# Altium schematic sheet Balance.SchDoc
size A3
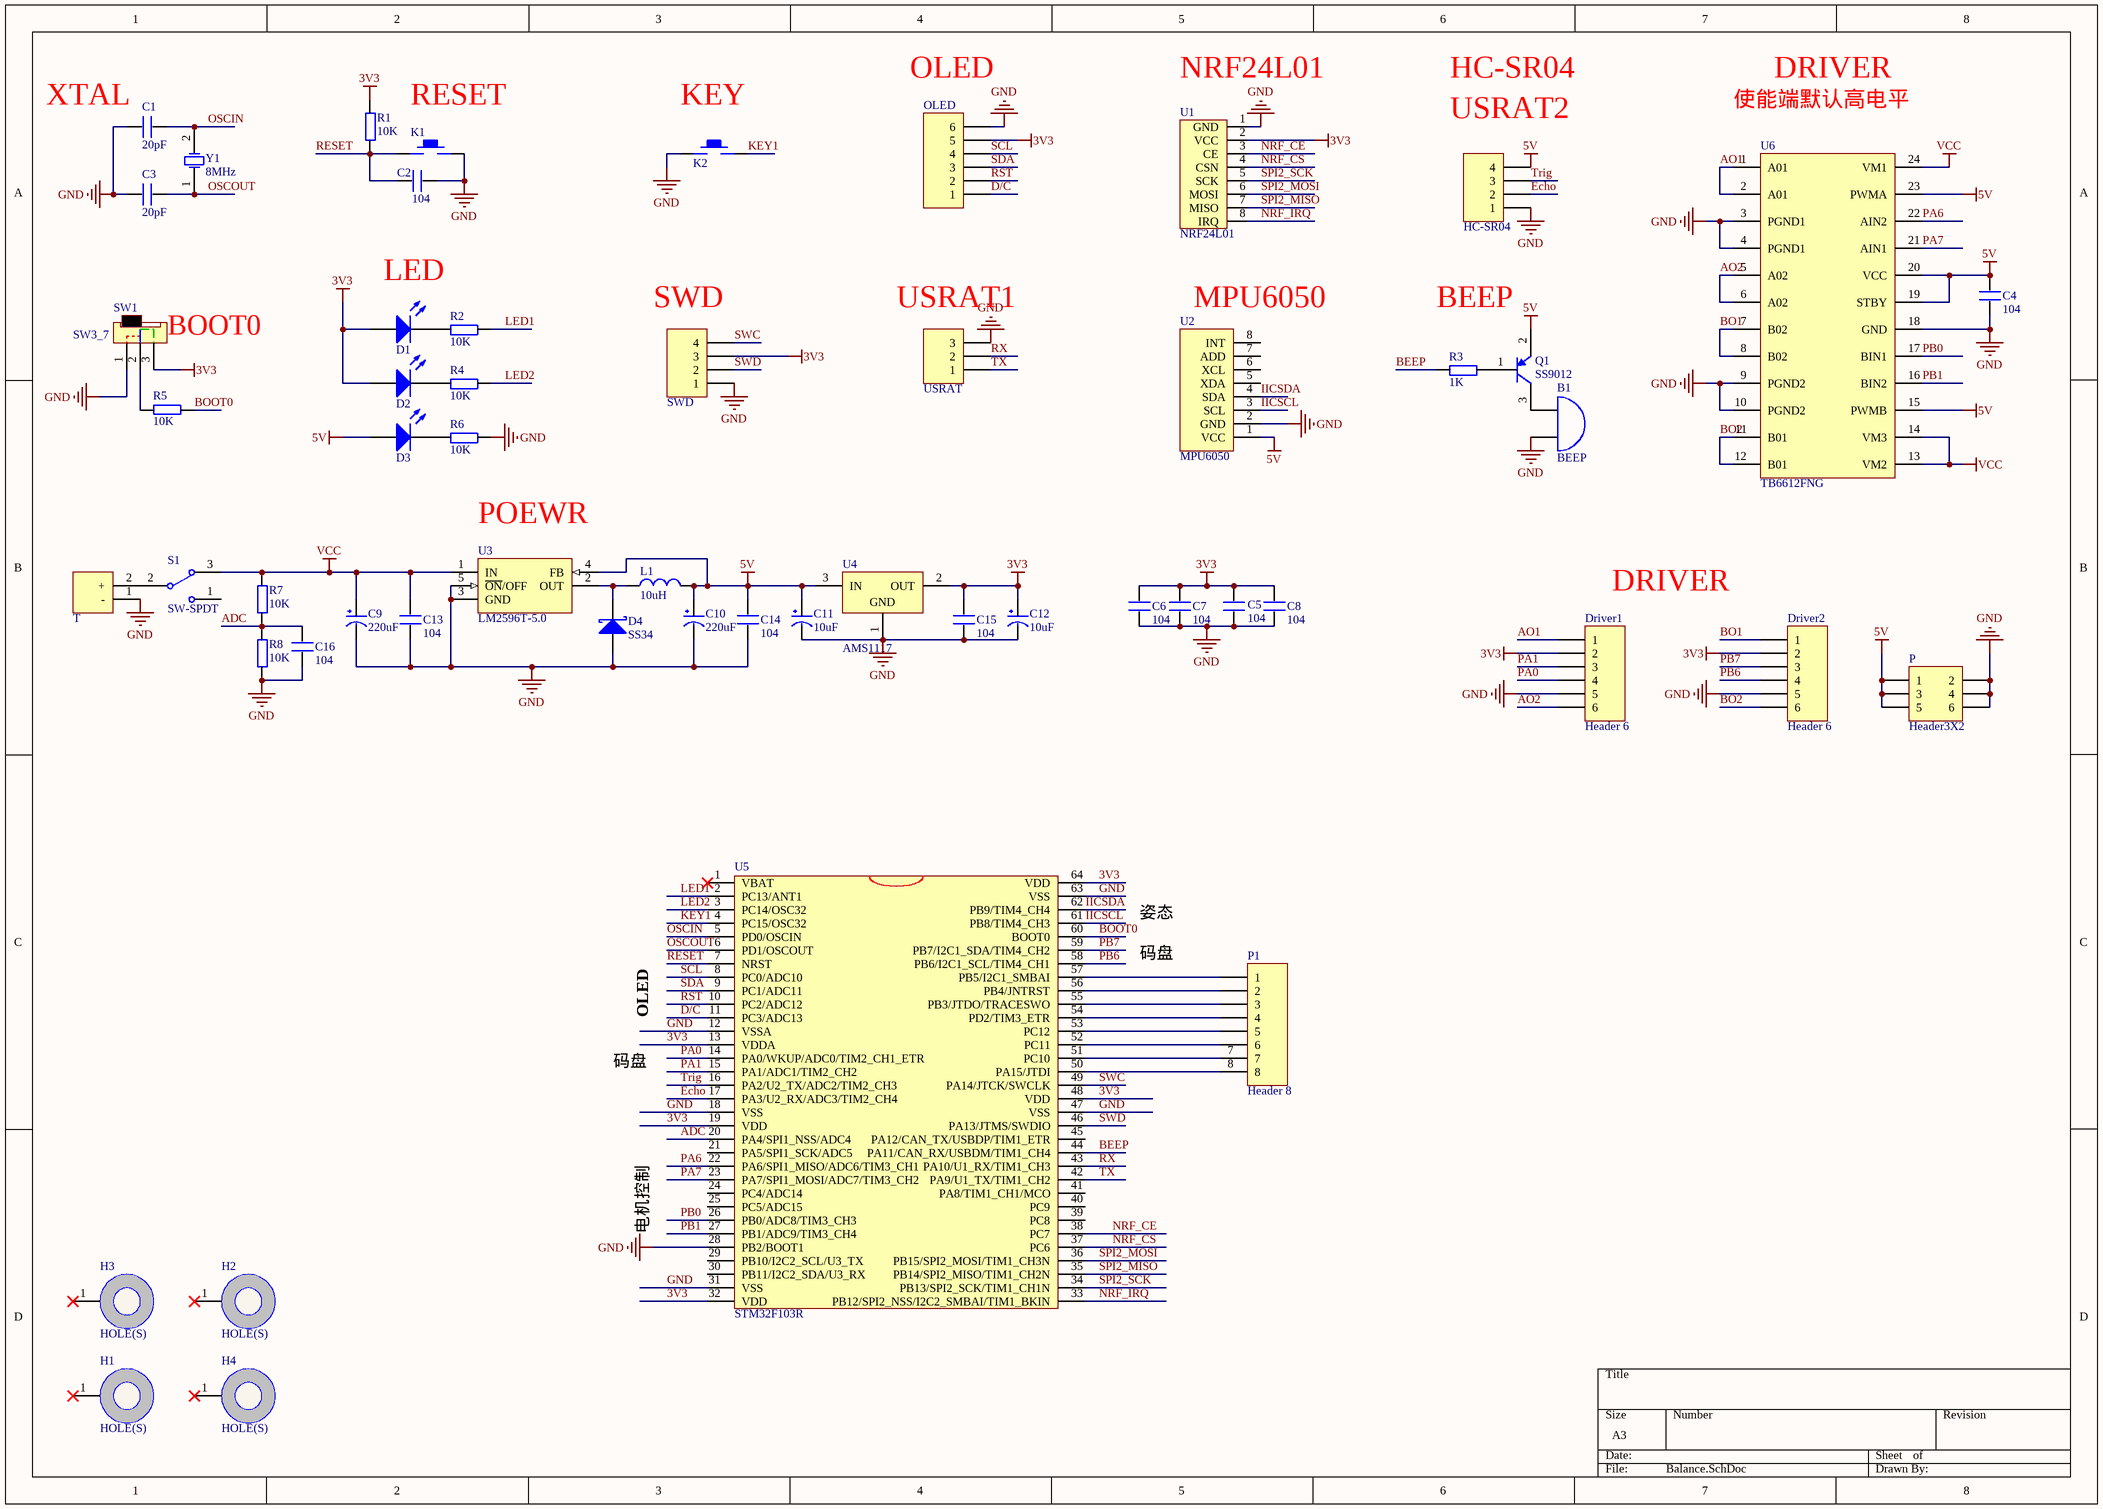
[diagram p0: Balance.SchDoc]

## Parts
B1  BEEP  [BEEP]
C1  20pF  [C-RAD-0805]
C2  104  [C-RAD-0805]
C3  20pF  [C-RAD-0805]
C4  104  [C-RAD-0805]
C5  104  [C-RAD-0805]
C6  104  [C-RAD-0805]
C7  104  [C-RAD-0805]
C8  104  [C-RAD-0805]
C9  220uF  [C-RB-8]
C10  220uF  [C-RB-8]
C11  10uF  [CAP-1206]
C12  10uF  [CAP-1206]
C13  104  [C-RAD-0805]
C14  104  [C-RAD-0805]
C15  104  [C-RAD-0805]
C16  104  [C-RAD-0805]
D1  LED  [SMDLED]  (value not drawn)
D2  LED  [SMDLED]  (value not drawn)
D3  LED  [SMDLED]  (value not drawn)
D4  Type: SS34  [SMA]  (hidden comment: D-Schottky)
Driver1  Header 6  [XH-6P]
Driver2  Header 6  [XH-6P]
H1  HOLE(S)  [HOLE9]
H2  HOLE(S)  [HOLE9]
H3  HOLE(S)  [HOLE9]
H4  HOLE(S)  [HOLE9]
HC-SR04  Header 4  [SIP4X2.54MM]  (value not drawn)
K1  KEY_M  [SW2P3X6X4.3(SMD)]  (value not drawn)
K2  KEY_M  [SW2P3X6X4.3(SMD)]  (value not drawn)
L1  value 10uH  [L-SMD-10]  (hidden comment: L)
OLED  (no value)  [SIP6X2.54MM]
P  Header3X2  [HDR3X2]
P1  Header 8  [SIP8X2.54MM]
Q1  SS9012  [SOT-23]
R1  10K  [0805]
R2  10K  [0805]
R3  1K  [0805]
R4  10K  [0805]
R5  10K  [0805]
R6  10K  [0805]
R7  10K  [0805]
R8  10K  [0805]
S1  SW-SPDT  [switch]
SW1  SW3_7  [MSK-02-7]
SWD  Header 4  [XH-4P]  (value not drawn)
T  TCON  [Tcon]  (value not drawn)
U1  NRF24L01  [NRF24L01]
U2  MPU6050  [SIP8X2.54MM]
U3  LM2596T-5.0  [TO-263-5]
U4  AMS1117  [AMS-1117]
U5  STM32F103R  [LQFP-64]
U6  TB6612FNG  [SSOP-24]
USRAT  Header 3  [XH-3P]  (value not drawn)
Y1  8MHz  [XTAL]

## Nets
3V3: C5.2 C6.2 C7.2 C8.2 C12.1(VCC) C15.2 D1.1(A) D2.1(A) Driver1.2 Driver2.2 OLED.5 R1.2 SW1.3 SWD.3 U1.2(VCC) U4.2(OUT) U5.13(VDDA) U5.19(VDD) U5.32(VDD) U5.48(VDD) U5.64(VDD)
5V: C4.2 C10.1(VCC) C11.1(VCC) C14.2 D3.1(A) HC-SR04.4 L1.2 P.1 P.3 P.5 Q1.2(E) U2.1(VCC) U3.4(FB) U4.3(IN) U6.15(PWMB) U6.19(STBY) U6.20(VCC) U6.23(PWMA)
GND: B1.2(B) C1.1 C2.1 C3.1 C4.1 C5.1 C6.1 C7.1 C8.1 C9.2(GND) C10.2(GND) C11.2(GND) C12.2(GND) C13.1 C14.1 C15.1 C16.1 D4.1(A) Driver1.5 Driver2.5 HC-SR04.1 K1.2 K2.1 OLED.6 P.2 P.4 P.6 R6.2 R8.1 SW1.1 SWD.1 T.1(-) U1.1(GND) U2.2(GND) U3.3(GND) U3.5(~{ON}/OFF) U4.1(GND) U5.12(VSSA) U5.18(VSS) U5.28(PB2/BOOT1) U5.31(VSS) U5.47(VSS) U5.63(VSS) U6.3(PGND1) U6.4(PGND1) U6.9(PGND2) U6.10(PGND2) U6.18(GND) USRAT.3
VCC: C9.1(VCC) C13.2 R7.2 S1.3 U3.1(IN) U6.13(VM2) U6.14(VM3) U6.24(VM1)
ADC: C16.2 R7.1 R8.2 U5.20(PA4/SPI1_NSS/ADC4)
AO1: Driver1.1 U6.1(A01) U6.2(A01)
AO2: Driver1.6 U6.5(A02) U6.6(A02)
BEEP: R3.1 U5.44(PA11/CAN_RX/USBDM/TIM1_CH4)
BO1: Driver2.1 U6.7(B02) U6.8(B02)
BO2: Driver2.6 U6.11(B01) U6.12(B01)
BOOT0: R5.1 U5.60(BOOT0)
D/C: OLED.1 U5.11(PC3/ADC13)
Echo: HC-SR04.2 U5.17(PA3/U2_RX/ADC3/TIM2_CH4)
IICSCL: U2.3(SCL) U5.61(PB8/TIM4_CH3)
IICSDA: U2.4(SDA) U5.62(PB9/TIM4_CH4)
KEY1: K2.2 U5.4(PC15/OSC32)
LED1: R2.2 U5.2(PC13/ANT1)
LED2: R4.2 U5.3(PC14/OSC32)
NRF_CE: U1.3(CE) U5.38(PC7)
NRF_CS: U1.4(CSN) U5.37(PC6)
NRF_IRQ: U1.8(IRQ) U5.33(PB12/SPI2_NSS/I2C2_SMBAI/TIM1_BKIN)
OSCIN: C1.2 U5.5(PD0/OSCIN) Y1.2(OSC2)
OSCOUT: C3.2 U5.6(PD1/OSCOUT) Y1.1(OSC1)
PA0: Driver1.4 U5.14(PA0/WKUP/ADC0/TIM2_CH1_ETR)
PA1: Driver1.3 U5.15(PA1/ADC1/TIM2_CH2)
PA6: U5.22(PA6/SPI1_MISO/ADC6/TIM3_CH1) U6.22(AIN2)
PA7: U5.23(PA7/SPI1_MOSI/ADC7/TIM3_CH2) U6.21(AIN1)
PB0: U5.26(PB0/ADC8/TIM3_CH3) U6.17(BIN1)
PB1: U5.27(PB1/ADC9/TIM3_CH4) U6.16(BIN2)
PB6: Driver2.4 U5.58(PB6/I2C1_SCL/TIM4_CH1)
PB7: Driver2.3 U5.59(PB7/I2C1_SDA/TIM4_CH2)
RESET: C2.2 K1.1 R1.1 U5.7(NRST)
RST: OLED.2 U5.10(PC2/ADC12)
RX: U5.43(PA10/U1_RX/TIM1_CH3) USRAT.2
SCL: OLED.4 U5.8(PC0/ADC10)
SDA: OLED.3 U5.9(PC1/ADC11)
SPI2_MISO: U1.7(MISO) U5.35(PB14/SPI2_MISO/TIM1_CH2N)
SPI2_MOSI: U1.6(MOSI) U5.36(PB15/SPI2_MOSI/TIM1_CH3N)
SPI2_SCK: U1.5(SCK) U5.34(PB13/SPI2_SCK/TIM1_CH1N)
SWC: SWD.4 U5.49(PA14/JTCK/SWCLK)
SWD: SWD.2 U5.46(PA13/JTMS/SWDIO)
Trig: HC-SR04.3 U5.16(PA2/U2_TX/ADC2/TIM2_CH3)
TX: U5.42(PA9/U1_TX/TIM1_CH2) USRAT.1
NetB1_1: B1.1(A) Q1.3(C)
NetD1_2: D1.2(K) R2.1
NetD2_2: D2.2(K) R4.1
NetD3_2: D3.2(K) R6.1
NetD4_2: D4.2(K) L1.1 U3.2(OUT)
NetP1_1: P1.1 U5.57(PB5/I2C1_SMBAI)
NetP1_2: P1.2 U5.56(PB4/JNTRST)
NetP1_3: P1.3 U5.55(PB3/JTDO/TRACESWO)
NetP1_4: P1.4 U5.54(PD2/TIM3_ETR)
NetP1_5: P1.5 U5.53(PC12)
NetP1_6: P1.6 U5.52(PC11)
NetP1_7: P1.7 U5.51(PC10)
NetP1_8: P1.8 U5.50(PA15/JTDI)
NetQ1_1: Q1.1(B) R3.2
NetR5_2: R5.2 SW1.2
NetS1_2: S1.2 T.2(+)

Not connected (* = marked no-connect by the designer): H1 1(HOLE)*; H2 1(HOLE)*; H3 1(HOLE)*; H4 1(HOLE)*; S1 1; U2 5(XDA) 6(XCL) 7(ADD) 8(INT); U5 1(VBAT)* 21(PA5/SPI1_SCK/ADC5) 24(PC4/ADC14) 25(PC5/ADC15) 29(PB10/I2C2_SCL/U3_TX) 30(PB11/I2C2_SDA/U3_RX) 39(PC8) 40(PC9) 41(PA8/TIM1_CH1/MCO) 45(PA12/CAN_TX/USBDP/TIM1_ETR)

## Notes on the sheet
- (near C1) XTAL
- RESET
- (near K2) KEY
- (near OLED) OLED
- (near U1) NRF24L01
- HC-SR04
- 使能端默认高电平
- DRIVER
- (near HC-SR04) USRAT2
- LED
- (near SWD) SWD
- (near USRAT) USRAT1
- (near U2) MPU6050
- BEEP
- (near SW1) BOOT0
- POEWR
- (near Driver1) DRIVER
- 姿态
- 码盘
- OLED
- 电机控制

## Library data of the parts
B1 = BEEP: 蜂鸣器; Published: 24-Mar-1999; LatestRevisionDate: 17-Jul-2002; LatestRevisionNote: Re-released for DXP Platform.; PackageReference: PIN2; Publisher: Altium Limited
C1-C8 C13-C16 = C: 无极性电容
C9-C12 = CAP: 极性电容
D1-D3 = LED: 发光二极管; Published: 8-Jun-2000; LatestRevisionDate: 08-Jul-2005; LatestRevisionNote: Mech Layer 1 removed.; PackageReference: LED-0; Publisher: Altium Limited
D4 = D-Schottky: 肖特基二极管; Published: 8-Jun-2000; LatestRevisionDate: 17-Jul-2002; LatestRevisionNote: Re-released for DXP Platform.; PackageReference: SMB; Publisher: Altium Limited; Code_JEDEC: DO-214-AA
Driver1 Driver2 OLED = Header 6: 接插件; LatestRevisionDate: 17-Jul-2002; LatestRevisionNote: Re-released for DXP Platform.; Publisher: Altium Limited
HC-SR04 SWD = Header 4: 接插件; LatestRevisionDate: 17-Jul-2002; LatestRevisionNote: Re-released for DXP Platform.; Publisher: Altium Limited
K1 K2 = KEY_M: 轻触按键
L1 = L: 电感; Code_IEC: 1005; Published: 8-Jun-2000; LatestRevisionDate: 17-Jul-2002; LatestRevisionNote: Re-released for DXP Platform.; PackageReference: 0402-A; Publisher: Altium Limited; Code_JEITA: 0402
P = Header3X2: 接插件; LatestRevisionDate: 17-Jul-2002; LatestRevisionNote: Re-released for DXP Platform.; Publisher: Altium Limited
P1 = Header 8: 接插件; LatestRevisionDate: 17-Jul-2002; LatestRevisionNote: Re-released for DXP Platform.; Publisher: Altium Limited
Q1 = SS8550: PNP贴片三极管; Published: 8-Jun-2000; LatestRevisionDate: 15-Jan-2003; LatestRevisionNote: PCB Footprint 'BCY-W3/D4.7' replaced; DatasheetDocument: 1997; PackageDocument: Sep-1998; PackageReference: TO-92A; Publisher: Altium Limited; Code_JEDEC: TO-92A; ComponentLink1Description: Manufacturer Link; ComponentLink1URL: http://www.fairchildsemi.com/; ComponentLink2Description: Datasheet; ComponentLink2URL: http://www.fairchildsemi.com/ds/2N%2F2N3906.pdf
R1-R8 = R
S1 = SW-SPDT: 开关; Published: 24-Mar-1999; LatestRevisionDate: 17-Dec-2003; LatestRevisionNote: Schematic revised, PCB Footprint replaced.; DatasheetDocument: 05-Dec-2000; PackageReference: TL36WW15050; Publisher: Altium Limited; ComponentLink1Description: Manufacturer Link; ComponentLink1URL: http://www.apem.com
SW1 = SW3_7: 3脚2档侧面拨动 7Pin微动开关
T = TCON: T插; LatestRevisionDate: 17-Jul-2002; LatestRevisionNote: Re-released for DXP Platform.; Publisher: Altium Limited
U1 = NRF24L01: 无线模块
U3 = LM2596T-5.0: 5V稳压芯片; Note: Tab is connected to GND; Published: 15-Apr-2002; DatasheetVersion: Dec-1997; PackageReference: TS5B; Publisher: Altium Limited; PackageDescription: D2-PAK; 5 Leads; Body 14.4 (inc. leads) x 10.4 mm (LxW max); ComponentLink1Description: Manufacturer Link; ComponentLink1URL: http://www.national.com/; ComponentLink2Description: Datasheet; ComponentLink2URL: http://www.national.com/ds.cgi/LM/LM2596.pdf; ComponentLink3Description: URL Link1; ComponentLink3URL: http://www.national.com/pf/LM/LM2596.html
U4 = AMS1117: 3.3V稳压
U5 = STM32F103R: STM32单片机48引脚
U6 = TB6612FNG: 电机驱动
USRAT = Header 3: 接插件; LatestRevisionDate: 17-Jul-2002; LatestRevisionNote: Re-released for DXP Platform.; Publisher: Altium Limited
Y1 = XTAL: Crystal Oscillator; Published: 8-Jun-2000; LatestRevisionDate: 17-Jul-2002; LatestRevisionNote: Re-released for DXP Platform.; Publisher: Altium Limited
U2 = MPU6050: LatestRevisionDate: 17-Jul-2002; LatestRevisionNote: Re-released for DXP Platform.; Publisher: Altium Limited